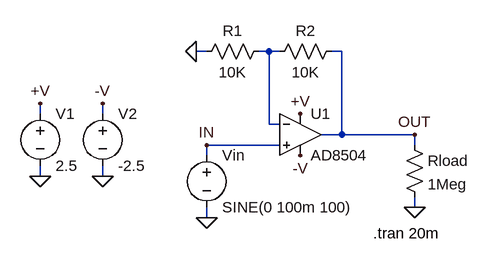
[diagram p0: schematic AD8504.asc]
AD8504.asc, the LTspice schematic file:
Version 4.1
SHEET 1 1240 700
WIRE 448 -1088 432 -1088
WIRE 544 -1088 528 -1088
WIRE 560 -1088 544 -1088
WIRE 656 -1088 640 -1088
WIRE 192 -992 192 -1008
WIRE 288 -992 288 -1008
WIRE 544 -976 544 -1088
WIRE 560 -976 544 -976
WIRE 656 -960 656 -1088
WIRE 656 -960 624 -960
WIRE 768 -960 656 -960
WIRE 560 -944 448 -944
WIRE 768 -944 768 -960
WIRE 448 -928 448 -944
WIRE 192 -896 192 -912
WIRE 288 -896 288 -912
WIRE 768 -848 768 -864
WIRE 448 -832 448 -848
FLAG 192 -1008 +V
FLAG 192 -896 0
FLAG 448 -832 0
FLAG 768 -960 OUT
FLAG 448 -944 IN
FLAG 592 -992 +V
FLAG 288 -1008 -V
FLAG 592 -928 -V
FLAG 432 -1088 0
FLAG 768 -848 0
FLAG 288 -896 0
SYMBOL voltage 192 -1008 R0
WINDOW 123 0 0 Left 2
WINDOW 39 0 0 Left 2
SYMATTR InstName V1
SYMATTR Value 2.5
SYMBOL voltage 448 -944 R0
WINDOW 123 24 146 Left 2
WINDOW 39 24 125 Left 2
SYMATTR InstName Vin
SYMATTR Value SINE(0 100m 100)
SYMBOL res 544 -1104 R90
WINDOW 0 0 56 VBottom 2
WINDOW 3 32 56 VTop 2
SYMATTR InstName R1
SYMATTR Value 10K
SYMBOL res 656 -1104 R90
WINDOW 0 0 56 VBottom 2
WINDOW 3 32 56 VTop 2
SYMATTR InstName R2
SYMATTR Value 10K
SYMBOL voltage 288 -1008 R0
WINDOW 123 24 146 Left 2
WINDOW 39 24 125 Left 2
SYMATTR InstName V2
SYMATTR Value -2.5
SYMBOL res 752 -960 R0
SYMATTR InstName Rload
SYMATTR Value 1Meg
SYMBOL AD8504 592 -1024 R0
SYMATTR InstName U1
TEXT 704 -808 Left 2 !.tran 20m

The netlist it stands for:
* AD8504.asc
V1 +V 0 2.5
Vin IN 0 SINE(0 100m 100)
R1 N001 0 10K
R2 OUT N001 10K
V2 -V 0 -2.5
Rload OUT 0 1Meg
* U1: AD8504 (symbol AD8504 not available, pins judged from their places): In+=IN In-=N001 V+=+V V-=-V OUT=OUT
.tran 20m
.backanno
.end